# Altium project PowerSupply.PrjPCB
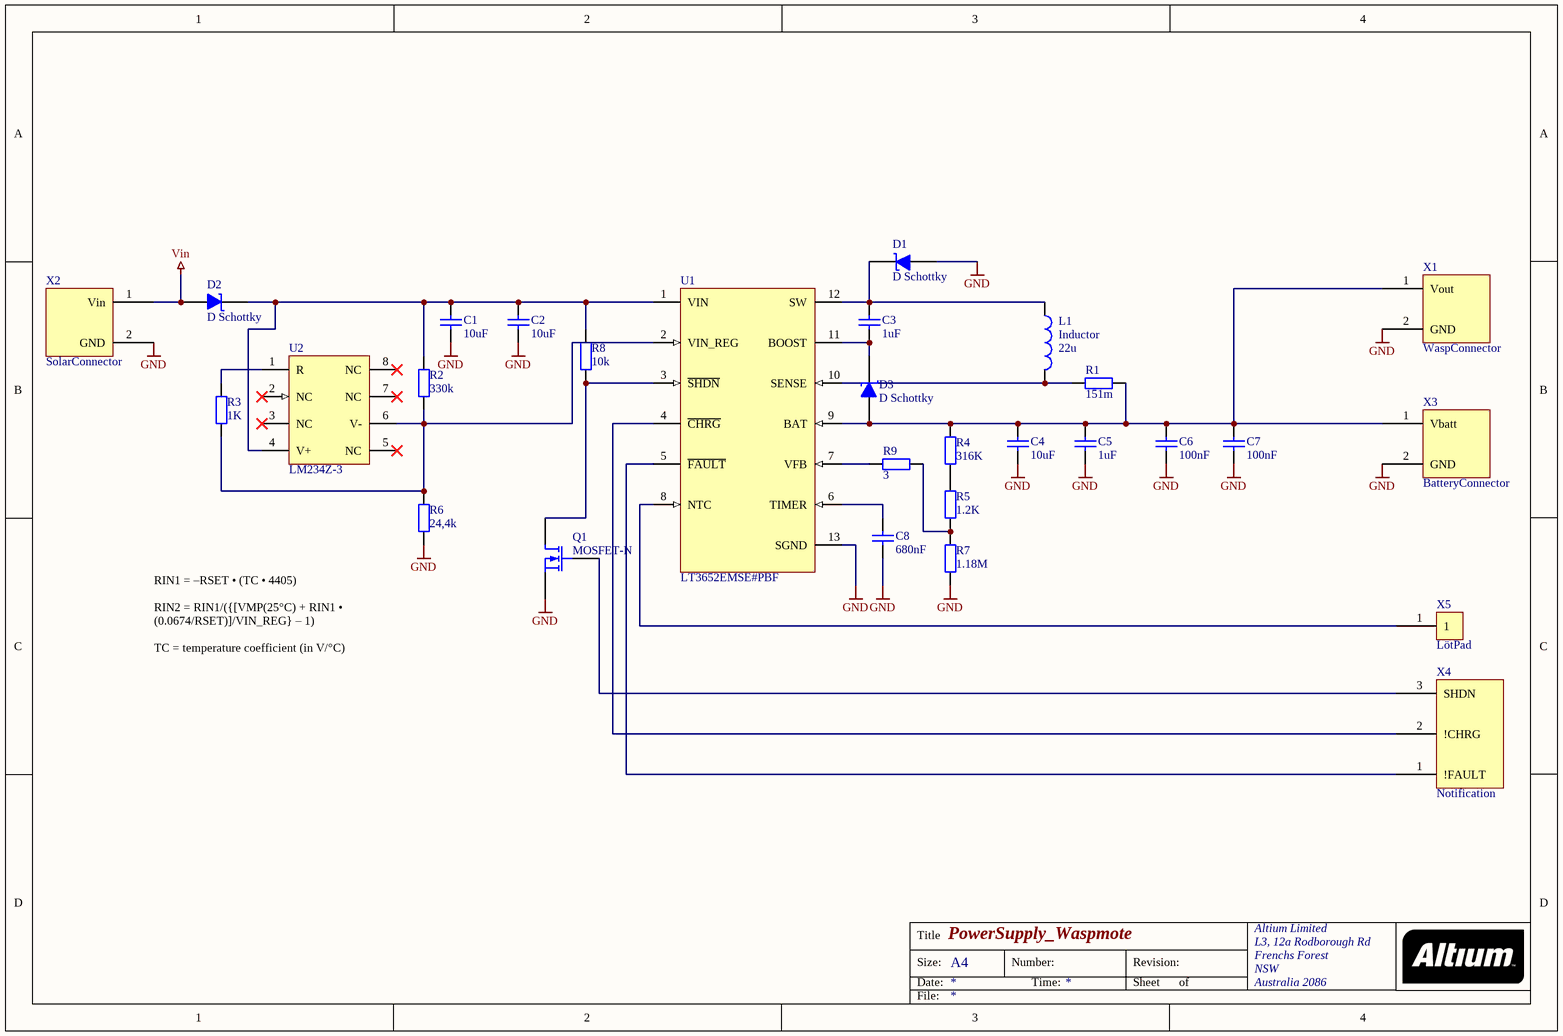
[diagram p0: power_supply.SchDoc]
1 sheet, 29 parts. Net scope: global (net labels, ports and power ports of the same name join across sheets).
Board files: PowerSupply.PcbDoc, PCB_Combined.PcbDoc

## Sheet power_supply.SchDoc: PowerSupply_Waspmote
size A4; Organization: Altium Limited; Address1: L3, 12a Rodborough Rd; Address2: Frenchs Forest; Address3: NSW; Address4: Australia 2086

### Parts
C1  10uF  [C1210]
C2  10uF  [C1210]
C3  1uF  [C1210]
C4  10uF  [C1210]
C5  1uF  [C1210]
C6  100nF  [0402]
C7  100nF  [0402]
C8  680nF  [0402]
D1  D Schottky  [SMB]
D2  D Schottky  [SMB]
D3  D Schottky  [SMB]
L1  Inductor  value 22u  [LMX131J]
Q1  MOSFET-N  [Sot-23]
R1  151m  [2510]
R2  330k  [0603]
R3  1K  [0603]
R4  316K  [0603]
R5  1.2K  [0603]
R6  24,4k  [0603]
R7  1.18M  [0402]
R8  10k  [0603]
R9  3  [0402]
U1  LT3652EMSE#PBF  [LT-MSE-12-EDP_N]
U2  LM234Z-3  [SO-8]
X1  WaspConnector  [Wasp_Connector]
X2  SolarConnector  [Solar_Connector]
X3  BatteryConnector  [Battery_Connector]
X4  Notification  [NOTIFICATION_CONNECTOR]
X5  LötPad  [LötPad]

### Nets
GND: C1.1 C2.1 C4.1 C5.1 C6.1 C7.1 C8.1 D1.1(A) Q1.3(S) R6.1 R7.1 U1.13(SGND) X1.2(GND) X2.2(GND) X3.2(GND)
Vin: D2.1(A) X2.1(Vin)
NetC1_2: C1.2 C2.2 D2.2(K) R2.2 R8.2 U1.1(VIN) U2.4(V+)
NetC3_1: C3.1 D3.2(K) U1.11(BOOST)
NetC3_2: C3.2 D1.2(K) L1.1 U1.12(SW)
NetC4_2: C4.2 C5.2 C6.2 C7.2 D3.1(A) R1.1 R4.2 U1.9(BAT) X1.1(Vout) X3.1(Vbatt)
NetC8_2: C8.2 U1.6(TIMER)
NetL1_2: L1.2 R1.2 U1.10(SENSE)
NetQ1_1: Q1.1(D) R8.1 U1.3(~{SHDN})
NetQ1_2: Q1.2(G) X4.3(SHDN)
NetR2_1: R2.1 R3.1 R6.2 U1.2(VIN_REG) U2.6(V-)
NetR3_2: R3.2 U2.1(R)
NetR4_1: R4.1 R5.2
NetR5_1: R5.1 R7.2 R9.1
NetR9_2: R9.2 U1.7(VFB)
NetU1_4: U1.4(~{CHRG}) X4.2(!CHRG)
NetU1_5: U1.5(~{FAULT}) X4.1(!FAULT)
NetU1_8: U1.8(NTC) X5.1

Not connected (* = marked no-connect by the designer): U2 2(NC)* 3(NC)* 5(NC)* 7(NC)* 8(NC)*

### Notes on the sheet
- RIN1 = –RSET • (TC • 4405)
  RIN2 = RIN1/({[VMP(25°C) + RIN1 • (0.0674/RSET)]/VIN_REG} – 1)
  TC = temperature coefficient (in V/°C)
- Title
- Size:
- Date:
- A4
- Number:
- Time:
- Revision:
- Sheet
- of
- File:

### Library data of the parts
C1-C8 = Cap Semi: Capacitor; Published: 8-Jun-2000; LatestRevisionDate: 29-May-2009; LatestRevisionNote: IPC-7351 Footprint Added.; PackageReference: C1206; Publisher: Altium Limited; PackageDescription: Chip Capacitor
  C1 C2 C4: Value: 10uF; Supplier 1: Farnell; Supplier 2: Digi-Key; Supplier Part Number 1: 1828859; Supplier Part Number 2: 490-1891-1-ND
  C3 C5: Value: 1uF; Supplier 1: Farnell; Supplier 2: Digi-Key; Supplier Part Number 2: 1276-3352-1-ND
  C6 C7: Value: 100nF; Supplier 1: Farnell; Supplier 2: Digi-Key; Supplier Part Number 1: 1844578; Supplier Part Number 2: 490-5920-1-ND
  C8: Value: 680nF
D1-D3 = D Schottky: Schottky Diode; Published: 8-Jun-2000; LatestRevisionDate: 17-Jul-2002; LatestRevisionNote: Re-released for DXP Platform.; PackageReference: SMB; Publisher: Altium Limited; PackageDescription: DO-214-AA/SMB; 2 C-Bend Leads; Body 5.3 x 3.6 mm, inc. leads (LxW); Code_JEDEC: DO-214-AA; Supplier Part Number 2: B340LB-FDICT-ND; Supplier 2: Digi-Key; Supplier Part Number 1: 1843684; Supplier 1: Farnell
Q1 = MOSFET-N: N-Channel MOSFET; Published: 8-Jun-2000; LatestRevisionDate: 17-Jul-2002; LatestRevisionNote: Re-released for DXP Platform.; PackageVersion: 1995/1996; PackageReference: E3; Publisher: Altium Limited; PackageDescription: TO, Flat Index; 3 In-Line, Axial Leads; Body Dia. 4.6mm; Lead Dia. 0.5 mm (max); Supplier Part Number 2: FDV301NCT-ND; Supplier 2: Digi-Key; Supplier 1: Farnell; Supplier Part Number 1: 9845011
R1-R9 = Res2: Resistor; Published: 8-Jun-2000; LatestRevisionDate: 17-Jul-2002; LatestRevisionNote: Re-released for DXP Platform.; PackageReference: AXIAL-0.4; Publisher: Altium Limited; PackageDescription: Axial Device, Thru-Hole; 2 Leads; 0.4 in Pin Spacing
  R1: Value: 151m; Supplier 2: Digi-Key; Supplier Part Number 2: WSLG-.151CT-ND
  R2: Value: 330k
  R3: Value: 1K
  R4: Value: 316K; Supplier 2: Digi-Key; Supplier Part Number 2: 311-316KHRCT-ND; Supplier 1: Farnell; Supplier Part Number 1: 2303268
  R5: Value: 1.2K; Supplier Part Number 1: 2059603; Supplier 1: Farnell; Supplier 2: Digi-Key; Supplier Part Number 2: 311-1.2KGRCT-ND
  R6: Value: 24,4k
  R7: Value: 1.18M; Supplier 1: Farnell; Supplier 2: Digi-Key; Supplier Part NUmber 2: 541-1.18MLCT-ND; Supplier Part Number 1: 2316670
  R8: Value: 10k; Supplier 1: Farnell; Supplier 2: Digi-Key; Supplier Part NUmber 2: 311-10KGRCT-ND; Supplier Part Number 1: 1795343
  R9: Value: 3; Supplier Part Number 2: 311-3.0JRCT-ND; Supplier 2: Digi-Key; Supplier 1: Farnell
U1 = LT3652EMSE#PBF: Battery Charger for Solar Power; Manufacturer: Linear Technology; Number of Outputs: 1; Vin Max(V): 32; Vin Min(V): 4.95; DatasheetVersion: Rev. D; PackageVersion: Rev. G, 05/2013; PackageReference: MSE-12-EDP; PackageDescription: 12-Pin Plastic MSOP, Exposed Die Pad, Body 4.039 x 3 mm, Pitch 0.65 mm; Supplier 1: Farnell; Supplier Part Number 1: 1839126; Supplier 2: Digi-Key; Supplier Part Number 2: LT3652EMSE#PBF-ND; Energy Source: Solar; RoHS: TRUE; Topology: Battery Charger; Mounting Technology: Surface Mount; PartNumber: LT3652EMSE#PBF; ComponentLink1Description: Manufacturer URL; ComponentLink1URL: http://www.linear.com/; ComponentLink2Description: Datasheet; ComponentLink2URL: http://cds.linear.com/docs/en/datasheet/3652fd.pdf; ComponentLink3Description: Package Specification; ComponentLink3URL: http://cds.linear.com/docs/en/packaging/05081666_G_MSE12.pdf; Value: LT3652EMSE#PBF
U2 = LM234Z-3: 3-Terminal Adjustable Current Source, 3-pin TO-92; Manufacturer: National Semiconductor; PackageTopMarking: NSXYTT*LM234*Z-3; PowerWise: N; CompType: MiscPower; High-Reliability: Y; DatasheetVersion: Mar-2005; PackageVersion: revG, Sep-2000; PackageReference: Z03A; PackageDescription: TO-92, Molded, 3 Lead; PartNumber: LM234Z-3; RoHS: N; PinCount: 3; Code_JEDEC: TO-226-AA; ComponentLink1Description: Manufacturer URL; ComponentLink1URL: http://www.national.com/; ComponentLink2Description: LM234 Datasheet; ComponentLink2URL: http://www.national.com/ds/LM/LM234.pdf; ComponentLink3Description: LM234 Web Page; ComponentLink3URL: http://www.national.com/pf/LM/LM234.html; ComponentLink4Description: Z03A Package Page; ComponentLink4URL: http://www.national.com/packaging/folders/z03a.html; Supplier part Number 1: 1467822; Supplier 1: Farnell; Supplier 2: Digikey; Supplier Part Number 2: 497-1549-1-ND; Value: LM234Z-3
X1 = WaspConnector: Connector; Supplier 1: Farnell; Supplier Part Number 1: 3705262; Supplier 2: Digi-Key; Supplier Part Number 2: 277-1150-ND
X2 = SolarConnector: Connector; Supplier Part Number 1: 3705262; Supplier Part Number 2: 277-1150-ND; Supplier 1: Farnell; Supplier 2: Digi-Key
X3 = BatteryConnector: Connector; Supplier 1: Farnell; Supplier 2: Digi-Key; Supplier Part Number 1: 3705262; Supplier Part Number 2: 277-1150-ND
X4 = Notification: Connector; Supplier 1: Farnell; Supplier 2: Digi-Key; Supplier Part Number 1: 3705274; Supplier Part Number 2: 277-1151-ND
X5 = LötPad: PAD
L1 = Inductor: Supplier 1: Farnell; Supplier 2: Digi-Key; Supplier Part Number 2: 478-7123-1-ND; Supplier Part Number 1: 2373880